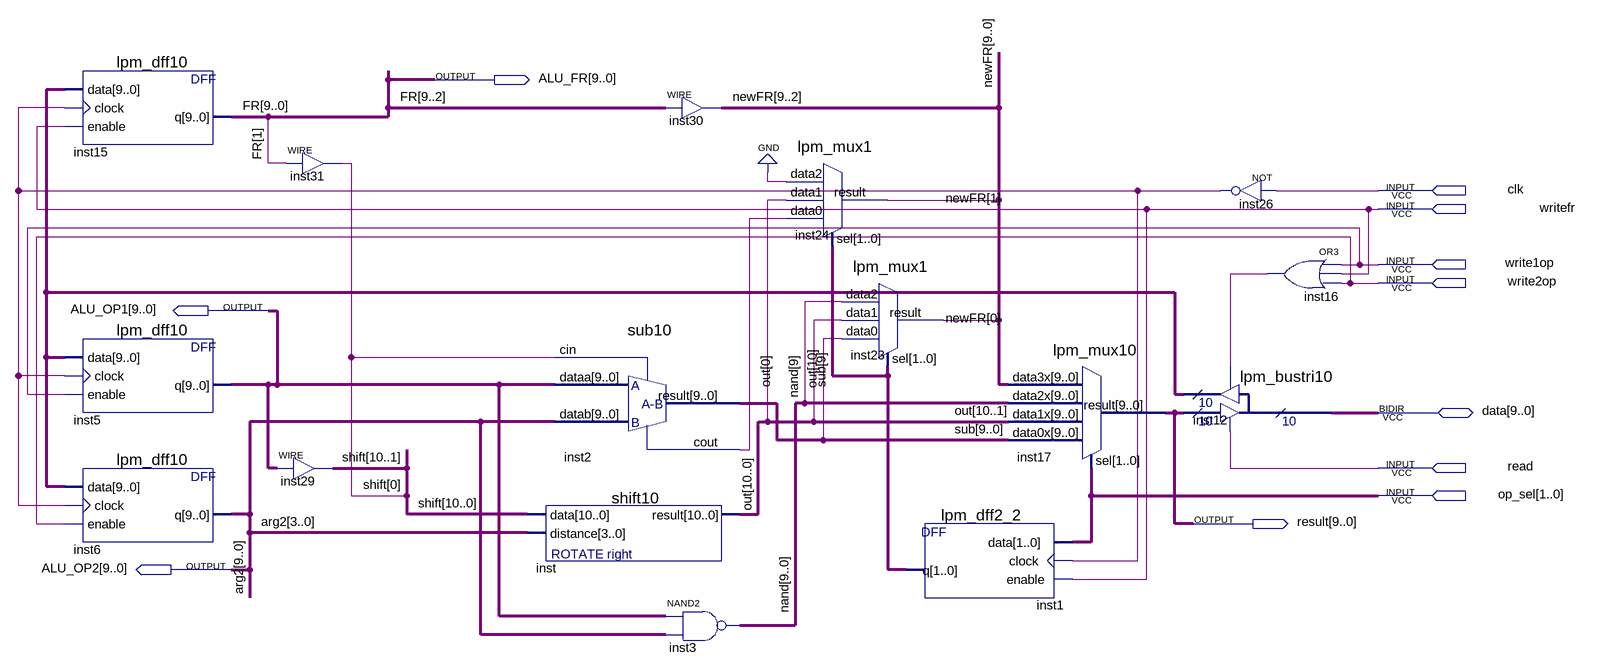
[diagram p0: schematic sheet]
// Quartus schematic alu.bdf as structural Verilog: 16 symbols, 11 pins
module alu (
  input  clk,
  input  writefr,
  input  write1op,
  input  write2op,
  input  read,
  input  [1:0] op_sel,
  inout  [9:0] data,
  output [9:0] ALU_FR,
  output [9:0] ALU_OP1,
  output [9:0] result,
  output [9:0] ALU_OP2
);

  wire inst2_cout, inst16_out, inst26_out;
  wire [1:0] inst1_q;
  wire [9:0] inst12_result, \nand , newFR, sub;
  wire [10:0] out, shift;

  lpm_dff10 inst15 (.data(inst12_result), .clock(inst26_out), .enable(writefr), .q(ALU_FR));
  lpm_dff10 inst5 (.data(inst12_result), .clock(inst26_out), .enable(write1op), .q(ALU_OP1));
  lpm_dff10 inst6 (.data(inst12_result), .clock(inst26_out), .enable(write2op), .q(ALU_OP2));
  assign shift[10:1] = ALU_OP1;  // WIRE inst29
  assign shift[0] = ALU_FR[1];  // WIRE inst31
  sub10 inst2 (.dataa(ALU_OP1), .datab(ALU_OP2), .cin(shift[0]), .result(sub), .cout(inst2_cout));
  shift10 inst (.data(shift), .distance(ALU_OP2[3:0]), .result(out));
  assign newFR[9:2] = ALU_FR[9:2];  // WIRE inst30
  assign \nand  = ~(ALU_OP1 & ALU_OP2);  // NAND2 inst3, 10 bits wide
  lpm_mux1 inst24 (.data2(1'b0), .data1(out[0]), .data0(inst2_cout), .sel(inst1_q), .result(newFR[1]));
  lpm_mux1 inst23 (.data2(\nand [9]), .data1(out[10]), .data0(sub[9]), .sel(inst1_q), .result(newFR[0]));
  lpm_dff2_2 inst1 (.data(op_sel), .clock(inst26_out), .enable(writefr), .q(inst1_q));
  lpm_mux10 inst17 (.data3x(newFR), .data2x(\nand ), .data1x(out[10:1]), .data0x(sub), .sel(op_sel), .result(result));
  not inst26 (inst26_out, clk);
  lpm_bustri10 inst12 (.enabledt(read), .data(result), .enabletr(inst16_out), .result(inst12_result), .tridata(data));
  or inst16 (inst16_out, write1op, writefr, write2op);

  // Other names for the same wires on the sheet: FR[9:0] = ALU_FR; arg2[9:0] = ALU_OP2
endmodule
